# Altium project 全联供输出板_V1.0.PrjPCB
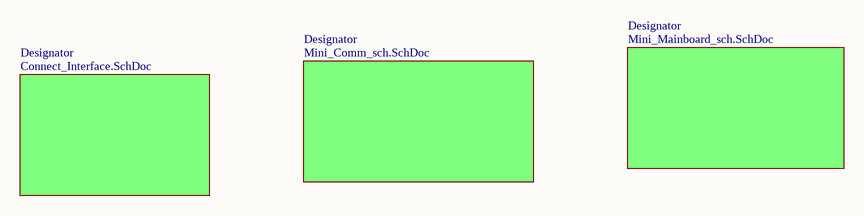
[diagram p0: 全联供输出板_V1.0.SchDoc]
3 sheets, 100 parts. Net scope: global (net labels, ports and power ports of the same name join across sheets).
Board files: 10515.0461_全联供输出板_V1.0.PcbDoc, 10515.0461_全联供输出板(2拼版)_V1.0.PcbDoc
Sheets:
  全联供输出板_V1.0.SchDoc
    Designator = Mini_Comm_sch.SchDoc
    Designator = Mini_Mainboard_sch.SchDoc

## Sheet 全联供输出板_V1.0.SchDoc
size A4

### Sub-sheets
Designator = Connect_Interface.SchDoc (file not in this document): no entries
Designator = Mini_Comm_sch.SchDoc: no entries
Designator = Mini_Mainboard_sch.SchDoc: no entries

## Sheet Mini_Comm_sch.SchDoc
size A3
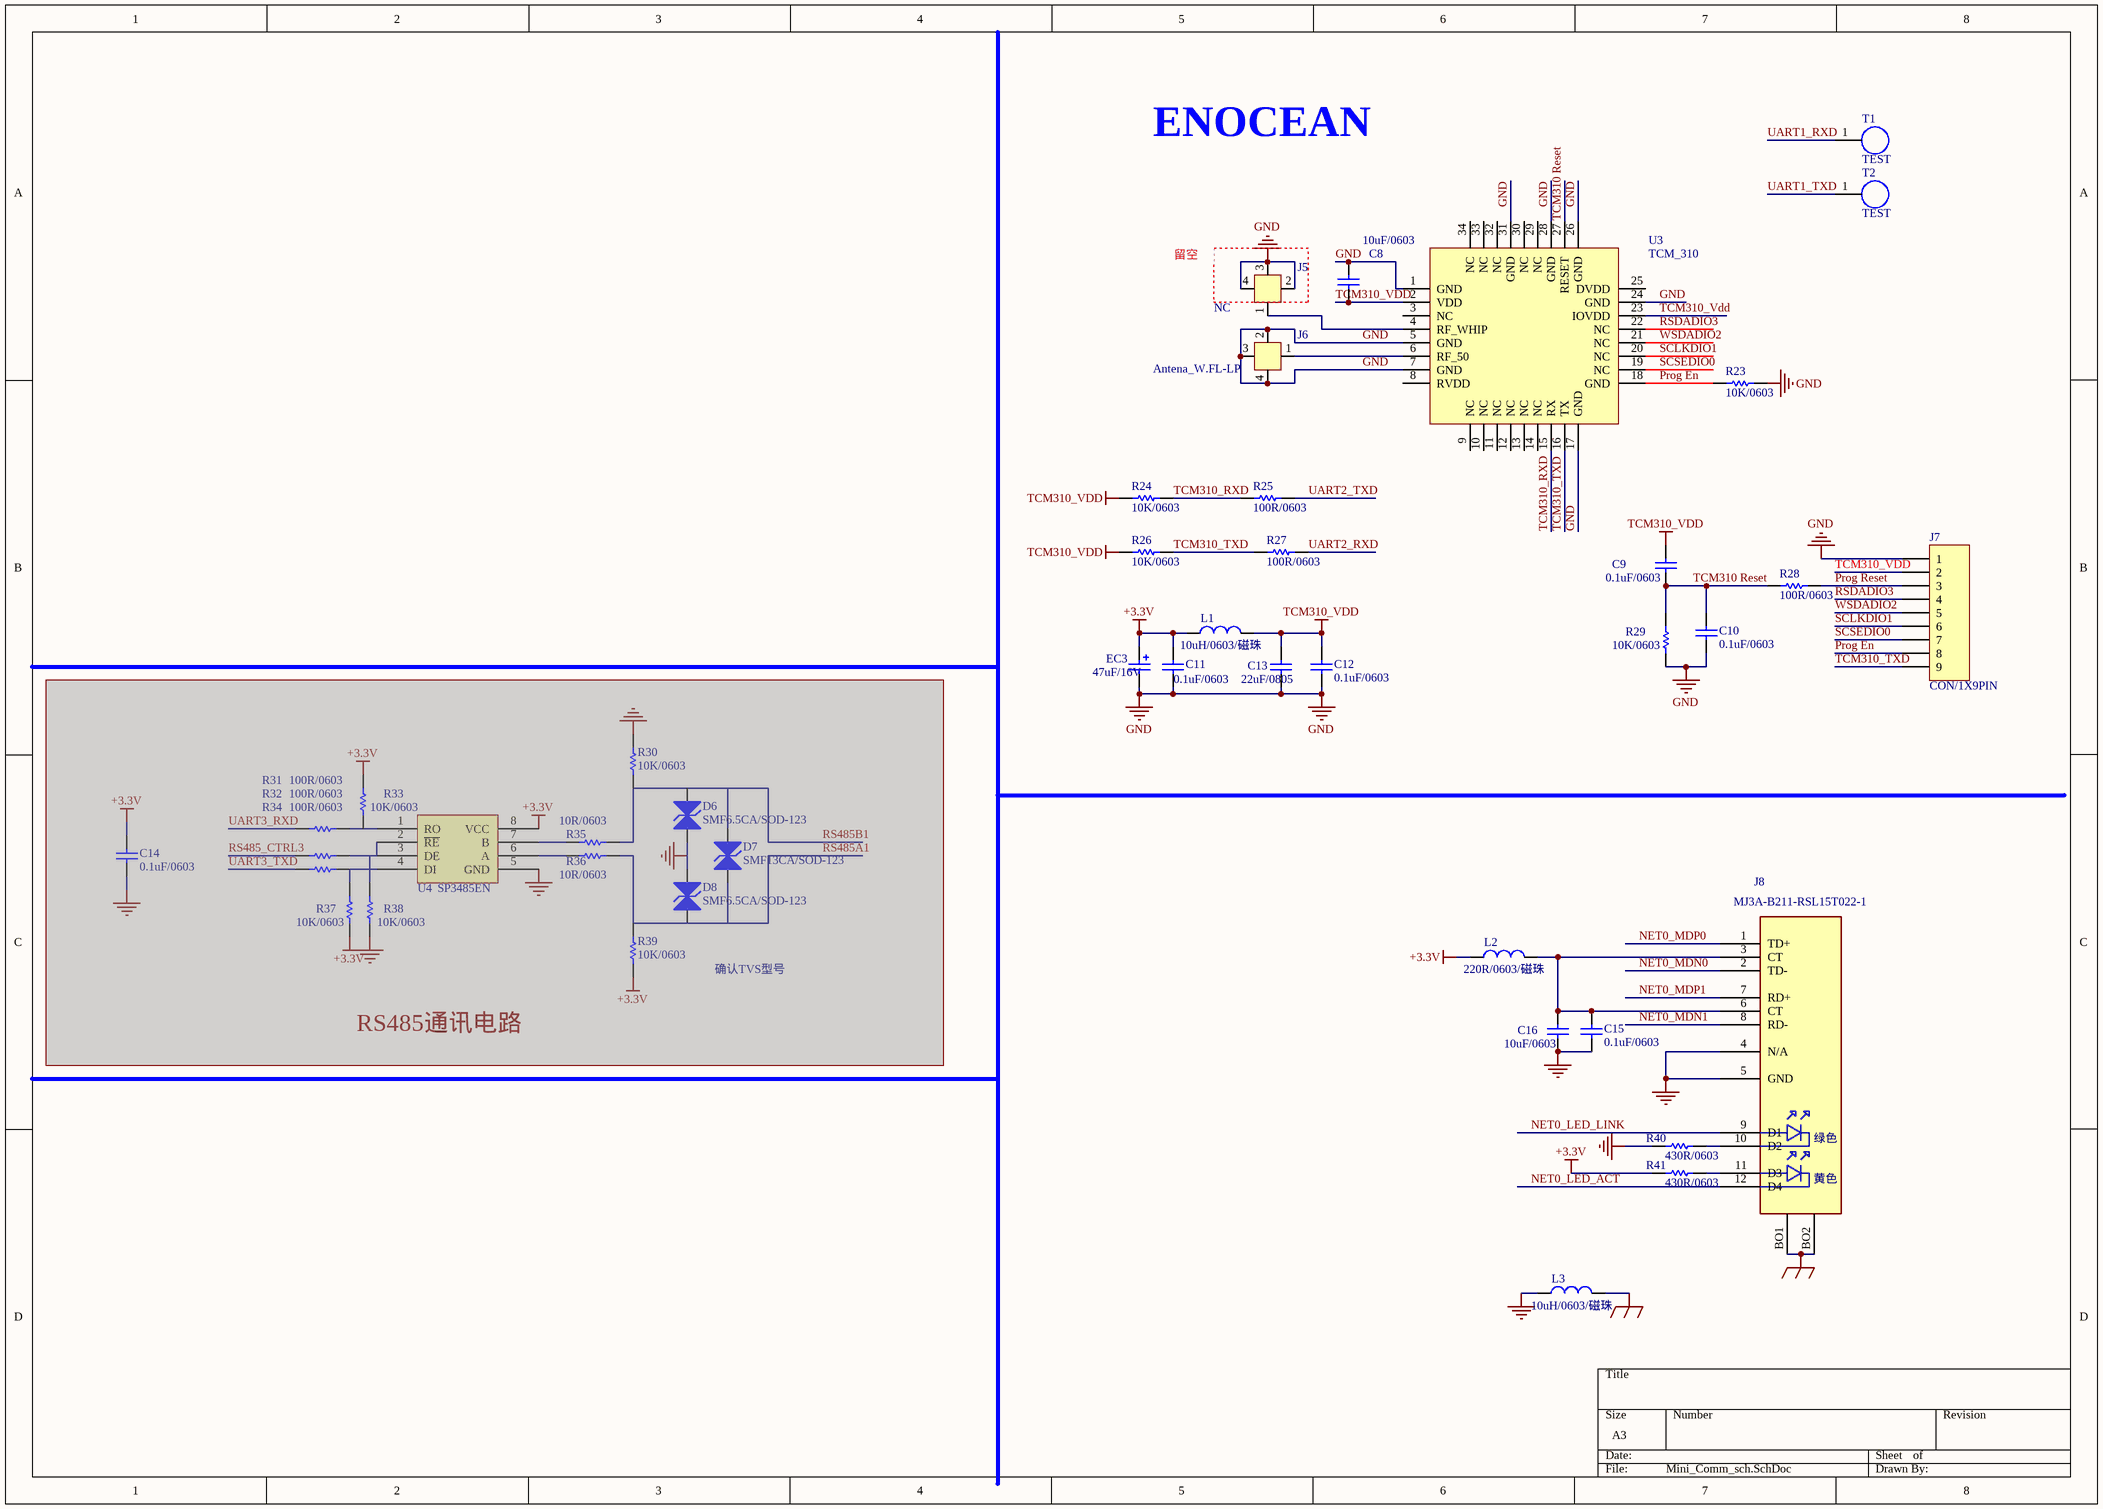
[diagram p1: Mini_Comm_sch.SchDoc]

### Parts
(Parts that share a designator on the sheet are numbered #1, #2 ... from top to bottom, then left to right.)
C8  10uF/0603  [CAP/SMT/0603C]
C9  0.1uF/0603  [CAP/SMT/0603C]
C10  0.1uF/0603  [CAP/SMT/0603C]
C11  0.1uF/0603  [CAP/SMT/0603C]
C12  0.1uF/0603  [CAP/SMT/0603C]
C13  22uF/0805  [CAP/SMT/0805C]
C14#1  0.1uF/0603  [CAP/SMT/0603C]  (masked out: inside a compile mask, not in the netlist)
C15  0.1uF/0603  [CAP/SMT/0603C]
C16  10uF/0603  [CAP/SMT/0603C]
D6#1  SMF6.5CA/SOD-123  [D/SMT/SOD123]  (masked out: inside a compile mask, not in the netlist)
D7#1  SMF13CA/SOD-123  [D/SMT/SOD123]  (masked out: inside a compile mask, not in the netlist)
D8  SMF6.5CA/SOD-123  [D/SMT/SOD123]  (masked out: inside a compile mask, not in the netlist)
EC3  47uF/16V  [CAP/SMT/47uF/16V]
J5  NC  [W.FL.LP-3MM]
J6  Antena_W.FL-LP  [W.FL.LP-3MM]
J7  CON/1X9PIN  [CON/DIP/1×9PIN/1.27MM]
J8  MJ3A-B211-RSL15T022-1  [RJ45-MJ3A-B211-RSL15T022-1]
L1  10uH/0603/磁珠  [0603R]
L2  220R/0603/磁珠  [0603R]
L3  10uH/0603/磁珠  [0603R]
R23  10K/0603  [0603R]
R24  10K/0603  [0603R]
R25  100R/0603  [0603R]
R26  10K/0603  [0603R]
R27  100R/0603  [0603R]
R28  100R/0603  [0603R]
R29  10K/0603  [0603R]
R30#1  10K/0603  [0603R]  (masked out: inside a compile mask, not in the netlist)
R31#1  100R/0603  [0603R]  (masked out: inside a compile mask, not in the netlist)
R32#1  100R/0603  [0603R]  (masked out: inside a compile mask, not in the netlist)
R33#1  10K/0603  [0603R]  (masked out: inside a compile mask, not in the netlist)
R34#1  100R/0603  [0603R]  (masked out: inside a compile mask, not in the netlist)
R35#1  10R/0603  [0603R]  (masked out: inside a compile mask, not in the netlist)
R36#1  10R/0603  [0603R]  (masked out: inside a compile mask, not in the netlist)
R37#1  10K/0603  [0603R]  (masked out: inside a compile mask, not in the netlist)
R38  10K/0603  [0603R]  (masked out: inside a compile mask, not in the netlist)
R39  10K/0603  [0603R]  (masked out: inside a compile mask, not in the netlist)
R40  430R/0603  [0603R]
R41  430R/0603  [0603R]
T1  TEST  [TEST]
T2  TEST  [TEST]
U3  TCM_310  [TCM310]
U4  SP3485EN  [SOIC-8]  (masked out: inside a compile mask, not in the netlist)

### Nets
+3.3V: C11.1 EC3.1 L1.1 L2.1 R41.2
EARTH: J8.BO1 J8.BO2 L3.2
GND: C8.2 C10.1 C11.2 C12.1 C13.1 C15.2 C16.1 EC3.2 J5.2(NC) J5.3(NC) J5.4(NC) J6.2(NC) J6.3(NC) J6.4(NC) J7.1 J8.4(N/A) J8.5(GND) L3.1 R23.1 R29.1 R40.2 U3.1(GND) U3.5(GND) U3.7(GND) U3.17(GND) U3.24(GND) U3.26(GND) U3.28(GND) U3.31(GND)
TCM310_Vdd: C8.1 C9.2 C12.2 C13.2 J7.2 L1.2 R24.2 R26.2 U3.2(VDD) U3.23(IOVDD)
NET0_LED_ACT: J8.12(D4)
NET0_LED_LINK: J8.9(D1)
NET0_MDN0: J8.2(TD-)
NET0_MDN1: J8.8(RD-)
NET0_MDP0: J8.1(TD+)
NET0_MDP1: J8.7(RD+)
Prog En: J7.8 R23.2 U3.18(GND)
Prog Reset: J7.3 R28.1
RSDADIO3: J7.4 U3.22(NC)
SCLKDIO1: J7.6 U3.20(NC)
SCSEDIO0: J7.7 U3.19(NC)
TCM310 Reset: C9.1 C10.2 R28.2 R29.2 U3.27(RESET)
TCM310_RXD: R24.1 R25.2 U3.15(RX)
TCM310_TXD: J7.9 R26.1 R27.2 U3.16(TX)
UART1_RXD: T1.1
UART1_TXD: T2.1
UART2_RXD: R27.1
UART2_TXD: R25.1
WSDADIO2: J7.5 U3.21(NC)
NetC15_1: C15.1 C16.2 J8.3(CT) J8.6(CT) L2.2
NetJ5_1: J5.1(NC) U3.4(RF_WHIP)
NetJ6_1: J6.1(NC) U3.6(RF_50)
NetJ8_10: J8.10(D2) R40.1
NetJ8_11: J8.11(D3) R41.1

Not connected (* = marked no-connect by the designer): U3 3(NC) 8(RVDD) 9(NC) 10(NC) 11(NC) 12(NC) 13(NC) 14(NC) 25(DVDD) 29(NC) 30(NC) 32(NC) 33(NC) 34(NC)

### Notes on the sheet
- ENOCEAN
- (near J5) 留空
- 确认TVS型号
- (in symbol RJ45B-48F-01GY2DPL2NL) 绿色; 黄色

### Library data of the parts
C8-C12 C14#1 C15 C16 = CAP/CAP/SMT/0603C
C13 = CAP/CAP/SMT/0805C
D6#1 D7#1 D8 = D/TVS/SMT/SMF13CA/SOD-123
EC3 = CAP/AEC/SMT/47uF/16V
J5 J6 = Antena
J7 = CON/DIP/1X9PIN/1.27MM
J8 = RJ45B-48F-01GY2DPL2NL: RJ45 + MAG
L1-L3 = INDUCTOR1
R23-R29 R30#1 R31#1 R32#1 R33#1 R34#1 R35#1 R36#1 R37#1 R38-R41 = RES/RES/SMT/0603
U4 = SP485EN: MAXIM: *; PackageReference: SOIC8
U3 = TCM_310: PackageReference: *

## Sheet Mini_Mainboard_sch.SchDoc
size A3
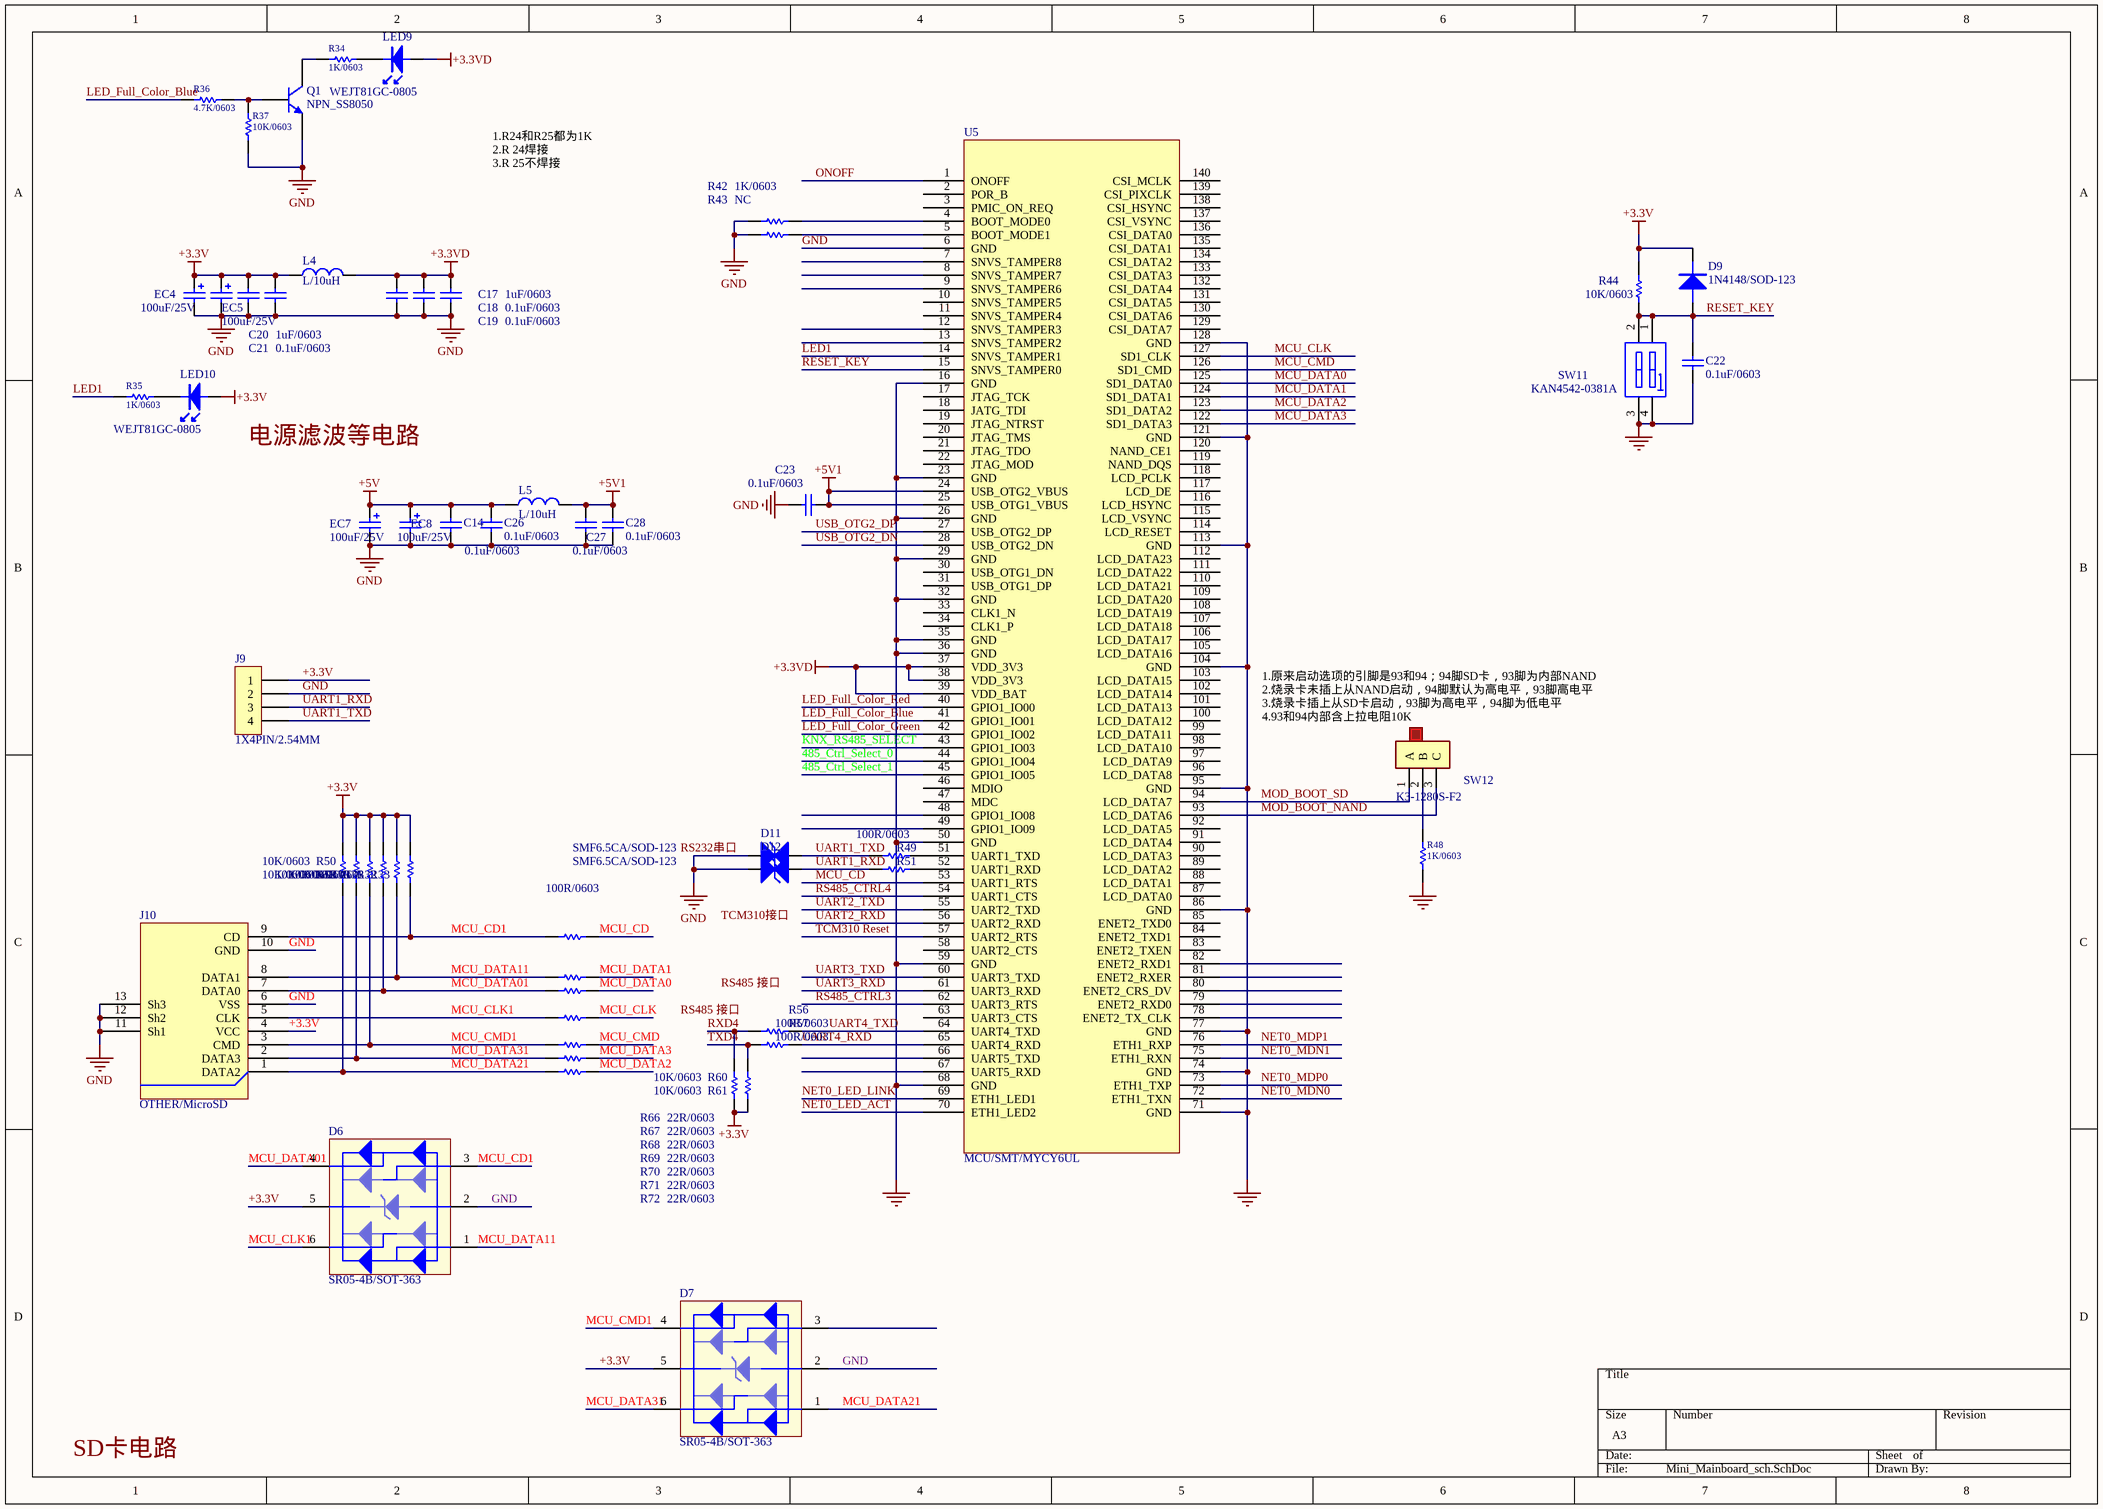
[diagram p2: Mini_Mainboard_sch.SchDoc]

### Parts
(Parts that share a designator on the sheet are numbered #1, #2 ... from top to bottom, then left to right.)
C14#2  0.1uF/0603  [CAP/SMT/0603C]
C17  1uF/0603  [CAP/SMT/0603C]
C18  0.1uF/0603  [CAP/SMT/0603C]
C19  0.1uF/0603  [CAP/SMT/0603C]
C20  1uF/0603  [CAP/SMT/0603C]
C21  0.1uF/0603  [CAP/SMT/0603C]
C22  0.1uF/0603  [CAP/SMT/0603C]
C23  0.1uF/0603  [CAP/SMT/0603C]
C26  0.1uF/0603  [CAP/SMT/0603C]
C27  0.1uF/0603  [CAP/SMT/0603C]
C28  0.1uF/0603  [CAP/SMT/0603C]
D6#2  SR05-4B/SOT-363  [TSOT-6L]
D7#2  SR05-4B/SOT-363  [TSOT-6L]
D9  1N4148/SOD-123  [D/SMT/SOD-123]
D11  SMF6.5CA/SOD-123  [D/SMT/SOD123]
D12  SMF6.5CA/SOD-123  [D/SMT/SOD123]
EC4  100uF/25V  [CAP/SMT/100UF/25V]
EC5  100uF/25V  [CAP/SMT/100UF/25V]
EC7  100uF/25V  [CAP/SMT/100UF/25V]
EC8  100uF/25V  [CAP/SMT/100UF/25V]
J9  1X4PIN/2.54MM  [CON/DIP/1×4PIN/2.54MM/插件端子]
J10  OTHER/MicroSD  [TF-01A]
L4  L/10uH  [L/SMT/0603L]
L5  L/10uH  [L/SMT/0603L]
LED9  WEJT81GC-0805  [D/SMT/LED/0805]
LED10  WEJT81GC-0805  [D/SMT/LED/0805]
Q1  NPN_SS8050  [BJT/SMT/SOT-23]
R30#2  10K/0603  [0603R]
R31#2  10K/0603  [0603R]
R32#2  10K/0603  [0603R]
R33#2  10K/0603  [0603R]
R34#2  1K/0603  [0603R]
R35#2  1K/0603  [0603R]
R36#2  4.7K/0603  [0603R]
R37#2  10K/0603  [0603R]
R42  1K/0603  [0603R]
R43  NC  [0603R]
R44  10K/0603  [0603R]
R48  1K/0603  [0603R]
R49  100R/0603  [0603R]
R50  10K/0603  [0603R]
R51  100R/0603  [0603R]
R52  10K/0603  [0603R]
R56  100R/0603  [0603R]
R57  100R/0603  [0603R]
R60  10K/0603  [0603R]
R61  10K/0603  [0603R]
R66  22R/0603  [0603R]
R67  22R/0603  [0603R]
R68  22R/0603  [0603R]
R69  22R/0603  [0603R]
R70  22R/0603  [0603R]
R71  22R/0603  [0603R]
R72  22R/0603  [0603R]
SW11  KAN4542-0381A  [SWITCH/KAN4542]
SW12  K3-1280S-F2  [SWITCH/K3-1280S-F2]
U5  MCU/SMT/MYCY6UL  [MYC140]

### Nets
+3.3V: C20.2 C21.2 D6#2.5 D7#2.5 D9.1(K) EC4.1 EC5.1 J9.1 J10.4(VCC) L4.1 LED10.2(A) R30#2.2 R31#2.2 R32#2.2 R33#2.2 R44.2 R50.2 R52.2 R60.2 R61.2
+3.3VD: C17.2 C18.2 C19.2 L4.2 LED9.2(A) U5.37(VDD_3V3) U5.38(VDD_3V3) U5.39(VDD_BAT)
+5V: C14#2.2 C26.2 EC7.1 EC8.1 L5.1
+5V1: C23.2 C27.2 C28.2 L5.2 U5.24(USB_OTG2_VBUS) U5.25(USB_OTG1_VBUS)
GND: C14#2.1 C17.1 C18.1 C19.1 C20.1 C21.1 C22.1 C23.1 C26.1 C27.1 C28.1 D6#2.2 D7#2.2 D11.2(K) D12.2(K) EC4.2 EC5.2 EC7.2 EC8.2 J9.2 J10.6(VSS) J10.10(GND) J10.11(Sh1) J10.12(Sh2) J10.13(Sh3) Q1.2(E) R37#2.1 R42.2 R43.2 R48.1 SW11.3(B2) SW11.4(B1) U5.6(GND) U5.16(GND) U5.23(GND) U5.26(GND) U5.29(GND) U5.32(GND) U5.35(GND) U5.36(GND) U5.50(GND) U5.59(GND) U5.68(GND) U5.71(GND) U5.74(GND) U5.77(GND) U5.86(GND) U5.95(GND) U5.104(GND) U5.113(GND) U5.121(GND) U5.128(GND)
485_Ctrl_Select_0: U5.44(GPIO1_IO04)
485_Ctrl_Select_1: U5.45(GPIO1_IO05)
KNX_RS485_SELECT: U5.43(GPIO1_IO03)
LED1: R35#2.1 U5.14(SNVS_TAMPER1)
LED_Full_Color_Blue: R36#2.1 U5.41(GPIO1_IO01)
LED_Full_Color_Green: U5.42(GPIO1_IO02)
LED_Full_Color_Red: U5.40(GPIO1_IO00)
MCU_CD: R66.1 U5.53(UART1_RTS)
MCU_CD1: D6#2.3 J10.9(CD) R33#2.1 R66.2
MCU_CLK: R69.1 U5.127(SD1_CLK)
MCU_CLK1: D6#2.6 J10.5(CLK) R69.2
MCU_CMD: R70.1 U5.126(SD1_CMD)
MCU_CMD1: D7#2.4 J10.3(CMD) R30#2.1 R70.2
MCU_DATA0: R68.1 U5.125(SD1_DATA0)
MCU_DATA01: D6#2.4 J10.7(DATA0) R31#2.1 R68.2
MCU_DATA1: R67.1 U5.124(SD1_DATA1)
MCU_DATA2: R72.1 U5.123(SD1_DATA2)
MCU_DATA3: R71.1 U5.122(SD1_DATA3)
MCU_DATA11: D6#2.1 J10.8(DATA1) R32#2.1 R67.2
MCU_DATA21: D7#2.1 J10.1(DATA2) R50.1 R72.2
MCU_DATA31: D7#2.6 J10.2(DATA3) R52.1 R71.2
MOD_BOOT_NAND: SW12.3(C) U5.93(LCD_DATA6)
MOD_BOOT_SD: SW12.1(A) U5.94(LCD_DATA7)
NET0_LED_ACT: U5.70(ETH1_LED2)
NET0_LED_LINK: U5.69(ETH1_LED1)
NET0_MDN0: U5.72(ETH1_TXN)
NET0_MDN1: U5.75(ETH1_RXN)
NET0_MDP0: U5.73(ETH1_TXP)
NET0_MDP1: U5.76(ETH1_RXP)
ONOFF: U5.1(ONOFF)
RESET_KEY: C22.2 D9.2(A) R44.1 SW11.1(A1) SW11.2(A2) U5.15(SNVS_TAMPER0)
RS485_CTRL3: U5.62(UART3_RTS)
RS485_CTRL4: U5.54(UART1_CTS)
RXD4: R56.2 R60.1
TCM310 Reset: U5.57(UART2_RTS)
TXD4: R57.2 R61.1
UART1_RXD: D12.1(A) J9.3 R51.1
UART1_TXD: D11.1(A) J9.4 R49.1
UART2_RXD: U5.56(UART2_RXD)
UART2_TXD: U5.55(UART2_TXD)
UART3_RXD: U5.61(UART3_RXD)
UART3_TXD: U5.60(UART3_TXD)
UART4_RXD: R57.1 U5.65(UART4_RXD)
UART4_TXD: R56.1 U5.64(UART4_TXD)
USB_OTG2_DN: U5.28(USB_OTG2_DN)
USB_OTG2_DP: U5.27(USB_OTG2_DP)
NetLED9_1: LED9.1(K) R34#2.1
NetLED10_1: LED10.1(K) R35#2.2
NetQ1_1: Q1.1(B) R36#2.2 R37#2.2
NetQ1_3: Q1.3(C) R34#2.2
NetR42_1: R42.1 U5.4(BOOT_MODE0)
NetR43_1: R43.1 U5.5(BOOT_MODE1)
NetR48_2: R48.2 SW12.2(B)
NetR49_2: R49.2 U5.51(UART1_TXD)
NetR51_2: R51.2 U5.52(UART1_RXD)

Not connected (* = marked no-connect by the designer): D7#2 3; U5 2(POR_B) 3(PMIC_ON_REQ) 7(SNVS_TAMPER8) 8(SNVS_TAMPER7) 9(SNVS_TAMPER6) 10(SNVS_TAMPER5) 11(SNVS_TAMPER4) 12(SNVS_TAMPER3) 13(SNVS_TAMPER2) 17(JTAG_TCK) 18(JATG_TDI) 19(JTAG_NTRST) 20(JTAG_TMS) 21(JTAG_TDO) 22(JTAG_MOD) 30(USB_OTG1_DN) 31(USB_OTG1_DP) 33(CLK1_N) 34(CLK1_P) 46(MDIO) 47(MDC) 48(GPIO1_IO08) 49(GPIO1_IO09) 58(UART2_CTS) 63(UART3_CTS) 66(UART5_TXD) 67(UART5_RXD) 78(ENET2_TX_CLK) 79(ENET2_RXD0) 80(ENET2_CRS_DV) 81(ENET2_RXER) 82(ENET2_RXD1) 83(ENET2_TXEN) 84(ENET2_TXD1) 85(ENET2_TXD0) 87(LCD_DATA0) 88(LCD_DATA1) 89(LCD_DATA2) 90(LCD_DATA3) 91(LCD_DATA4) 92(LCD_DATA5) 96(LCD_DATA8) 97(LCD_DATA9) 98(LCD_DATA10) 99(LCD_DATA11) 100(LCD_DATA12) 101(LCD_DATA13) 102(LCD_DATA14) 103(LCD_DATA15) 105(LCD_DATA16) 106(LCD_DATA17) 107(LCD_DATA18) 108(LCD_DATA19) 109(LCD_DATA20) 110(LCD_DATA21) 111(LCD_DATA22) 112(LCD_DATA23) 114(LCD_RESET) 115(LCD_VSYNC) 116(LCD_HSYNC) 117(LCD_DE) 118(LCD_PCLK) 119(NAND_DQS) 120(NAND_CE1) 129(CSI_DATA7) 130(CSI_DATA6) 131(CSI_DATA5) 132(CSI_DATA4) 133(CSI_DATA3) 134(CSI_DATA2) 135(CSI_DATA1) 136(CSI_DATA0) 137(CSI_VSYNC) 138(CSI_HSYNC) 139(CSI_PIXCLK) 140(CSI_MCLK)

### Notes on the sheet
- 1.R24和R25都为1K
  2.R 24焊接
  3.R 25不焊接
- (near SW12) 1.原来启动选项的引脚是93和94；94脚SD卡，93脚为内部NAND
  2.烧录卡未插上从NAND启动，94脚默认为高电平，93脚高电平
  3.烧录卡插上从SD卡启动，93脚为高电平，94脚为低电平
  4.93和94内部含上拉电阻10K
- Labels drawn without touching a wire or pin: MOD_BOOT_NAND, RS232串口, RS485 接口, SD卡电路, TCM310接口, 电源滤波等电路

### Library data of the parts
C14#2 C17-C23 C26-C28 = CAP/CAP/SMT/0603C
D6#2 D7#2 = D/TVS/SMT/SR05-4B/SOT-363
D9 = D/D/SMT/1N4148/SOD-123: VR=75V T(-65-175)P(0.5W)VF=0.6V
D11 D12 = D/TVS/SMT/SMF13CA/SOD-123
EC4 EC5 EC7 EC8 = CAP/AEC/SMT/100uF/25V
J9 = CON/DIP/1X4PIN/2.54MM: Connector
L4 L5 = L/BEAD/SMT/0603L
LED9 LED10 = D/LED/SMT/BL-HUF35A-TRB高亮红/0805
Q1 = BJT/NPN/SMT/SS8050/SOT-23: Published: *; Publisher: *; Manufacturer: *; Class: *; SubClass: *
R30#2 R31#2 R32#2 R33#2 R42-R44 R49-R52 R56 R57 R60 R61 R66-R72 = RES/RES/SMT/0603
R34#2 R35#2 R36#2 R37#2 R48 = Res: Resistor; Published: *; Publisher: *; Manufacturer: *; Class: *; SubClass: *; Value: *
SW11 = SWITCH/TACT/SMT/KAN4542-0381A: 4.5mm*4.5mm*3.8mm
SW12 = SWITCH/DIP/K3-1280S-F2

## Nets that join several sheets
+3.3V: Mini_Comm_sch (5 pins), Mini_Mainboard_sch (20 pins)
GND: Mini_Comm_sch (29 pins), Mini_Mainboard_sch (52 pins)
NET0_LED_ACT: Mini_Comm_sch (J8.12), Mini_Mainboard_sch (U5.70)
NET0_LED_LINK: Mini_Comm_sch (J8.9), Mini_Mainboard_sch (U5.69)
NET0_MDN0: Mini_Comm_sch (J8.2), Mini_Mainboard_sch (U5.72)
NET0_MDN1: Mini_Comm_sch (J8.8), Mini_Mainboard_sch (U5.75)
NET0_MDP0: Mini_Comm_sch (J8.1), Mini_Mainboard_sch (U5.73)
NET0_MDP1: Mini_Comm_sch (J8.7), Mini_Mainboard_sch (U5.76)
TCM310 Reset: Mini_Comm_sch (5 pins), Mini_Mainboard_sch (U5.57)
UART1_RXD: Mini_Comm_sch (T1.1), Mini_Mainboard_sch (D12.1 J9.3 R51.1)
UART1_TXD: Mini_Comm_sch (T2.1), Mini_Mainboard_sch (D11.1 J9.4 R49.1)
UART2_RXD: Mini_Comm_sch (R27.1), Mini_Mainboard_sch (U5.56)
UART2_TXD: Mini_Comm_sch (R25.1), Mini_Mainboard_sch (U5.55)